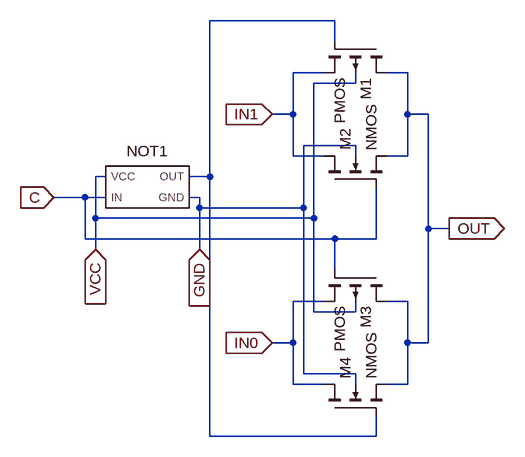
[diagram p0: schematic mux_2to1.asc]
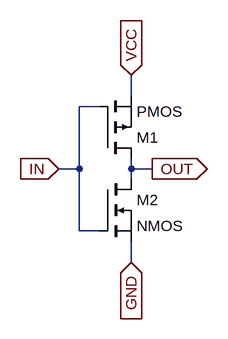
[diagram p1: sub-circuit not.asc]
mux_2to1.asc, the LTspice schematic file:
Version 4.1
SHEET 1 880 696
WIRE 192 48 0 48
WIRE 192 80 192 48
WIRE 176 128 128 128
WIRE 304 128 272 128
WIRE 224 144 224 128
WIRE 224 144 160 144
WIRE 128 192 128 128
WIRE 128 192 96 192
WIRE 304 192 304 128
WIRE 336 192 304 192
WIRE 224 240 144 240
WIRE 128 256 128 192
WIRE 176 256 128 256
WIRE 224 256 224 240
WIRE 304 256 304 192
WIRE 304 256 272 256
WIRE -160 288 -176 288
WIRE 0 288 0 48
WIRE 0 288 -32 288
WIRE -192 320 -240 320
WIRE -160 320 -192 320
WIRE -16 320 -32 320
WIRE -16 336 -16 320
WIRE 144 336 144 240
WIRE 144 336 -16 336
WIRE -176 352 -176 288
WIRE 160 352 160 144
WIRE 160 352 -176 352
WIRE 336 368 336 192
WIRE 368 368 336 368
WIRE -192 384 -192 320
WIRE 192 384 -192 384
WIRE 256 384 256 304
WIRE 256 384 192 384
WIRE -176 400 -176 352
WIRE -16 400 -16 336
WIRE 192 432 192 384
WIRE 176 480 128 480
WIRE 304 480 272 480
WIRE 160 496 160 352
WIRE 224 496 224 480
WIRE 224 496 160 496
WIRE 128 544 128 480
WIRE 128 544 96 544
WIRE 304 544 304 480
WIRE 336 544 336 368
WIRE 336 544 304 544
WIRE 144 592 144 336
WIRE 224 592 144 592
WIRE 128 608 128 544
WIRE 176 608 128 608
WIRE 224 608 224 592
WIRE 304 608 304 544
WIRE 304 608 272 608
WIRE 0 688 0 288
WIRE 256 688 256 656
WIRE 256 688 0 688
FLAG 368 368 OUT
IOPIN 368 368 Out
FLAG 96 192 IN1
IOPIN 96 192 In
FLAG 96 544 IN0
IOPIN 96 544 In
FLAG -240 320 C
IOPIN -240 320 In
FLAG -176 400 VCC
IOPIN -176 400 In
FLAG -16 400 GND
IOPIN -16 400 In
SYMBOL not -96 304 R0
SYMATTR InstName NOT1
SYMBOL pmos4 272 80 R90
SYMATTR InstName M1
SYMBOL pmos4 272 432 R90
SYMATTR InstName M3
SYMBOL nmos4 176 304 R270
SYMATTR InstName M2
SYMBOL nmos4 176 656 R270
SYMATTR InstName M4

not.asc, the sub-circuit schematic file:
Version 4.1
SHEET 1 880 680
WIRE 176 48 176 16
WIRE 128 64 96 64
WIRE 96 160 96 64
WIRE 96 160 64 160
WIRE 176 160 176 144
WIRE 208 160 176 160
WIRE 176 176 176 160
WIRE 96 256 96 160
WIRE 128 256 96 256
WIRE 176 304 176 272
FLAG 64 160 IN
IOPIN 64 160 In
FLAG 208 160 OUT
IOPIN 208 160 Out
FLAG 176 16 VCC
IOPIN 176 16 In
FLAG 176 304 GND
IOPIN 176 304 In
SYMBOL pmos 128 144 M180
SYMATTR InstName M1
SYMBOL nmos 128 176 R0
SYMATTR InstName M2

The netlist it stands for:
* mux_2to1.asc
X§NOT1 GND C VCC N001 not
M1 OUT N001 IN1 VCC PMOS
M3 OUT C IN0 VCC PMOS
M2 IN1 C OUT GND NMOS
M4 IN0 N001 OUT GND NMOS

* block symbol definitions
.subckt not GND IN VCC OUT
M1 OUT IN VCC VCC PMOS
M2 OUT IN GND GND NMOS
.ends not

.model NMOS NMOS
.model PMOS PMOS
.lib standard.mos
.backanno
.end